# Altium project aaa.PrjPCB
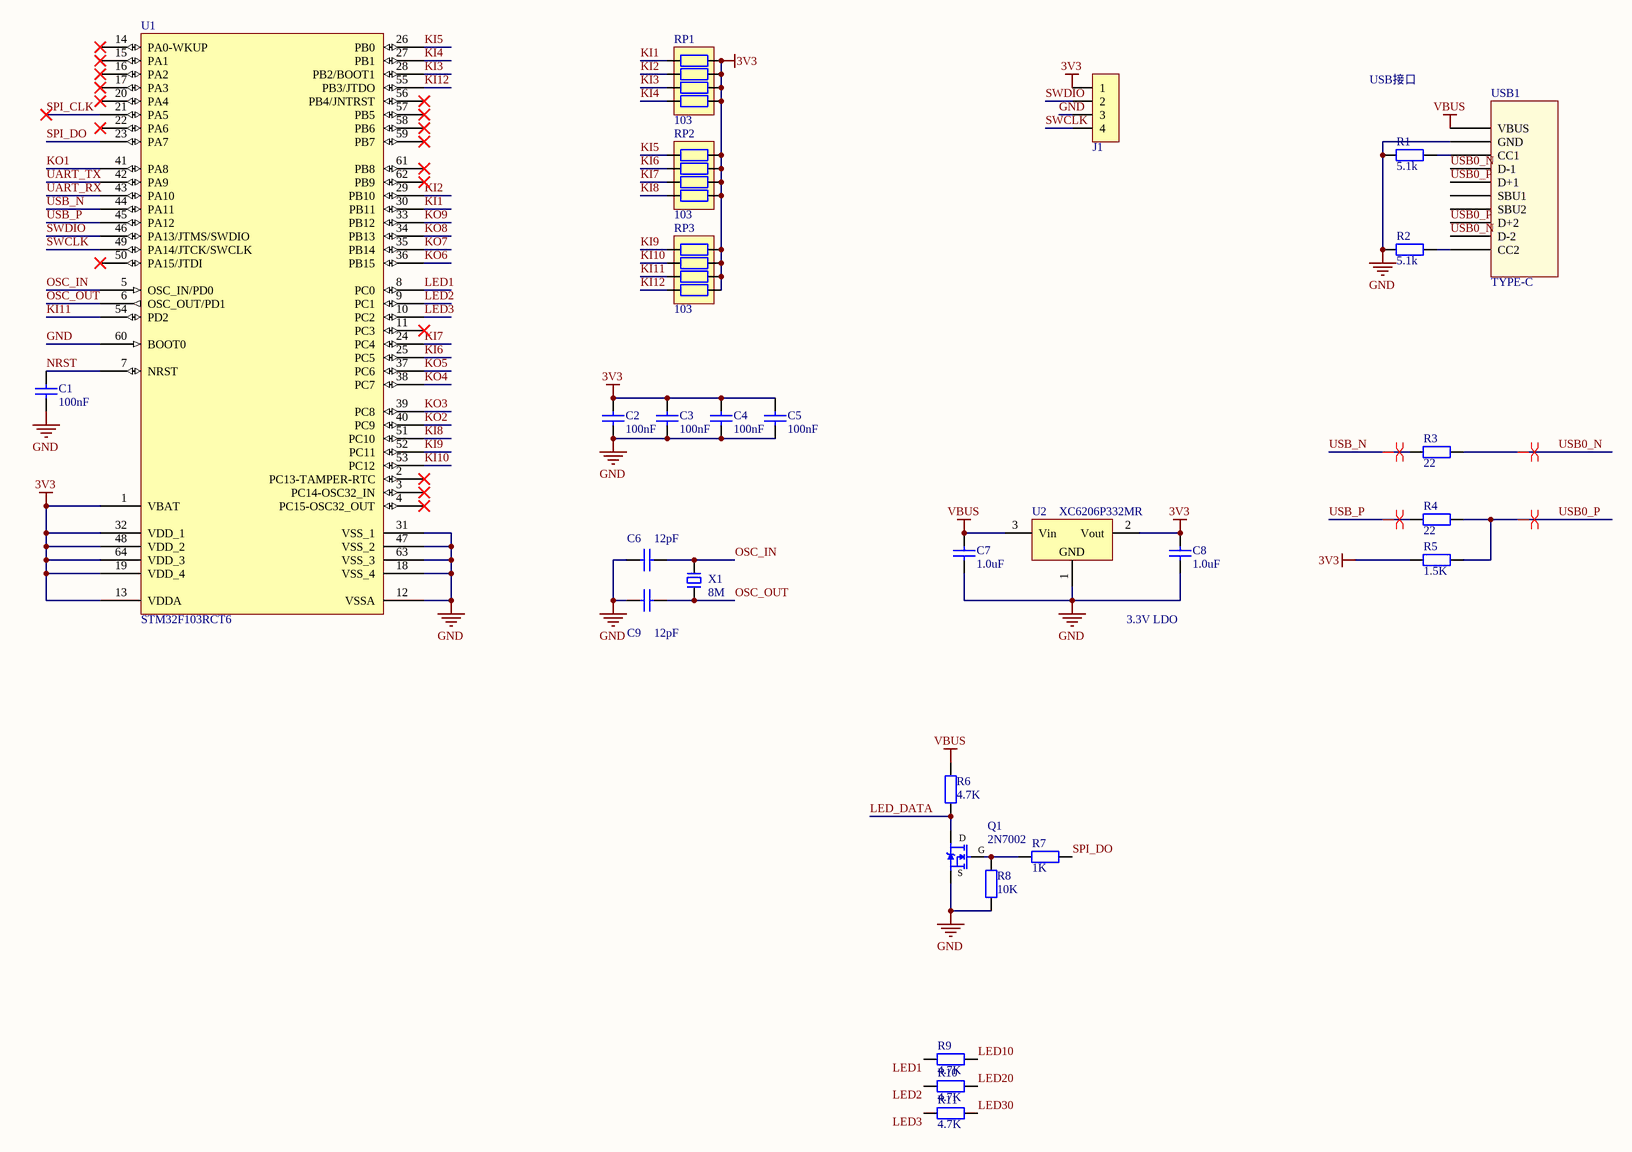
[diagram p0: aaa.SchDoc]
1 sheet, 29 parts. Net scope: global (net labels, ports and power ports of the same name join across sheets).
Board file: aaa.PcbDoc

## Sheet aaa.SchDoc
size A3

### Parts
C1  value 100nF  [C-RAD-0603]  (hidden comment: Cap)
C2  value 100nF  [C-RAD-0603]  (hidden comment: Cap)
C3  value 100nF  [C-RAD-0603]  (hidden comment: Cap)
C4  value 100nF  [C-RAD-0603]  (hidden comment: Cap)
C5  value 100nF  [C-RAD-0603]  (hidden comment: Cap)
C6  value 12pF  [C-RAD-0603]  (hidden comment: Cap)
C7  value 1.0uF  [C-RAD-0603]  (hidden comment: Cap)
C8  value 1.0uF  [C-RAD-0603]  (hidden comment: Cap)
C9  value 12pF  [C-RAD-0603]  (hidden comment: Cap)
J1  HDR-1X4  [HDR2.0-LI-4P]  (value not drawn)
Q1  2N7002  [SOT23-3N]
R1  value 5.1k  [0603-1]  (hidden comment: Res1)
R2  value 5.1k  [0603-1]  (hidden comment: Res1)
R3  value 22  [0603-1]  (hidden comment: Res1)
R4  value 22  [0603-1]  (hidden comment: Res1)
R5  value 1.5K  [0603-1]  (hidden comment: Res1)
R6  value 4.7K  [0603-1]  (hidden comment: Res1)
R7  value 1K  [0603-1]  (hidden comment: Res1)
R8  value 10K  [0603-1]  (hidden comment: Res1)
R9  value 4.7K  [0603-1]  (hidden comment: Res1)
R10  value 4.7K  [0603-1]  (hidden comment: Res1)
R11  value 4.7K  [0603-1]  (hidden comment: Res1)
RP1  103  [RCA-8P4R-0603]
RP2  103  [RCA-8P4R-0603]
RP3  103  [RCA-8P4R-0603]
U1  STM32F103RCT6  [LQFP64 10x10_N]
U2  XC6206P332MR  [SOT23-3N]
USB1  TYPE-C  [TYPE-C]
X1  value 8M  [X_5032]  (hidden comment: XTAL-2P)

### Nets
3V3: C2.2 C3.2 C4.2 C5.2 C8.2 J1.1 R5.2 RP1.5 RP1.6 RP1.7 RP1.8 RP2.5 RP2.6 RP2.7 RP2.8 RP3.5 RP3.6 RP3.7 RP3.8 U1.1(VBAT) U1.13(VDDA) U1.19(VDD_4) U1.32(VDD_1) U1.48(VDD_2) U1.64(VDD_3) U2.2(Vout)
GND: C1.1 C2.1 C3.1 C4.1 C5.1 C6.2 C7.1 C8.1 C9.2 J1.3 Q1.2(S) R1.2 R2.2 R8.2 U1.12(VSSA) U1.18(VSS_4) U1.31(VSS_1) U1.47(VSS_2) U1.60(BOOT0) U1.63(VSS_3) U2.1(GND) USB1.GND
VBUS: C7.2 R6.1 U2.3(Vin) USB1.VBUS
KI1: RP1.1 U1.30(PB11)
KI2: RP1.2 U1.29(PB10)
KI3: RP1.3 U1.28(PB2/BOOT1)
KI4: RP1.4 U1.27(PB1)
KI5: RP2.1 U1.26(PB0)
KI6: RP2.2 U1.25(PC5)
KI7: RP2.3 U1.24(PC4)
KI8: RP2.4 U1.51(PC10)
KI9: RP3.1 U1.52(PC11)
KI10: RP3.2 U1.53(PC12)
KI11: RP3.3 U1.54(PD2)
KI12: RP3.4 U1.55(PB3/JTDO)
KO1: U1.41(PA8)
KO2: U1.40(PC9)
KO3: U1.39(PC8)
KO4: U1.38(PC7)
KO5: U1.37(PC6)
KO6: U1.36(PB15)
KO7: U1.35(PB14)
KO8: U1.34(PB13)
KO9: U1.33(PB12)
LED1: R9.1 U1.8(PC0)
LED2: R10.1 U1.9(PC1)
LED3: R11.1 U1.10(PC2)
LED10: R9.2
LED20: R10.2
LED30: R11.2
LED_DATA: Q1.3(D) R6.2
NRST: C1.2 U1.7(NRST)
OSC_IN: C6.1 U1.5(OSC_IN/PD0) X1.2
OSC_OUT: C9.1 U1.6(OSC_OUT/PD1) X1.1
SPI_CLK: U1.21(PA5)
SPI_DO: R7.1 U1.23(PA7)
SWCLK: J1.4 U1.49(PA14/JTCK/SWCLK)
SWDIO: J1.2 U1.46(PA13/JTMS/SWDIO)
UART_RX: U1.43(PA10)
UART_TX: U1.42(PA9)
USB0_N: R3.1 USB1.D-1 USB1.D-2
USB0_P: R4.1 R5.1 USB1.D+1 USB1.D+2
USB_N: R3.2 U1.44(PA11)
USB_P: R4.2 U1.45(PA12)
NetQ1_1: Q1.1(G) R7.2 R8.1
NetR1_1: R1.1 USB1.CC1
NetR2_1: R2.1 USB1.CC2

Not connected (* = marked no-connect by the designer): U1 2(PC13-TAMPER-RTC)* 3(PC14-OSC32_IN)* 4(PC15-OSC32_OUT)* 11(PC3)* 14(PA0-WKUP)* 15(PA1)* 16(PA2)* 17(PA3)* 20(PA4)* 22(PA6)* 50(PA15/JTDI)* 56(PB4/JNTRST)* 57(PB5)* 58(PB6)* 59(PB7)* 61(PB8)* 62(PB9)*; USB1 SBU1 SBU2

### Layout directives
differential pair: USB0_N, USB0_P, USB_N, USB_P

### Notes on the sheet
- USB接口
- 3.3V LDO

### Library data of the parts
C1-C9 = Cap: 无极性电容; Published: 8-Jun-2000; LatestRevisionDate: 17-Jul-2002; LatestRevisionNote: Re-released for DXP Platform.; PackageReference: RAD-0.3; Publisher: Altium Limited
J1 = Header 4: 4P接插件; 版权归属: 源创客; BOM名称: 4P接插件; 学习资源: www.ooocke.com
Q1 = SI2302: N沟道 20V/3A; BOM名称: 场效应管
R1-R11 = Res1: 贴片电阻; Published: 8-Jun-2000; LatestRevisionDate: 17-Jul-2002; LatestRevisionNote: Re-released for DXP Platform.; PackageReference: AXIAL-0.4; Publisher: Altium Limited
RP1-RP3 = R-8P4R: 贴片网络排阻; 版权归属: 源创客; BOM名称: 贴片网络排阻; 学习资源: www.ooocke.com
U2 = XC6206P332MR: 低压差线性稳压芯片; 版权归属: 源创客; BOM名称: 低压差线性稳压芯片; 学习资源: www.ooocke.com
USB1 = USB-C
X1 = XTAL-2P: 2脚无源脚晶振